# EAGLE schematic STOMPBOX_2.0 v3 (EAGLE 9.7.0)
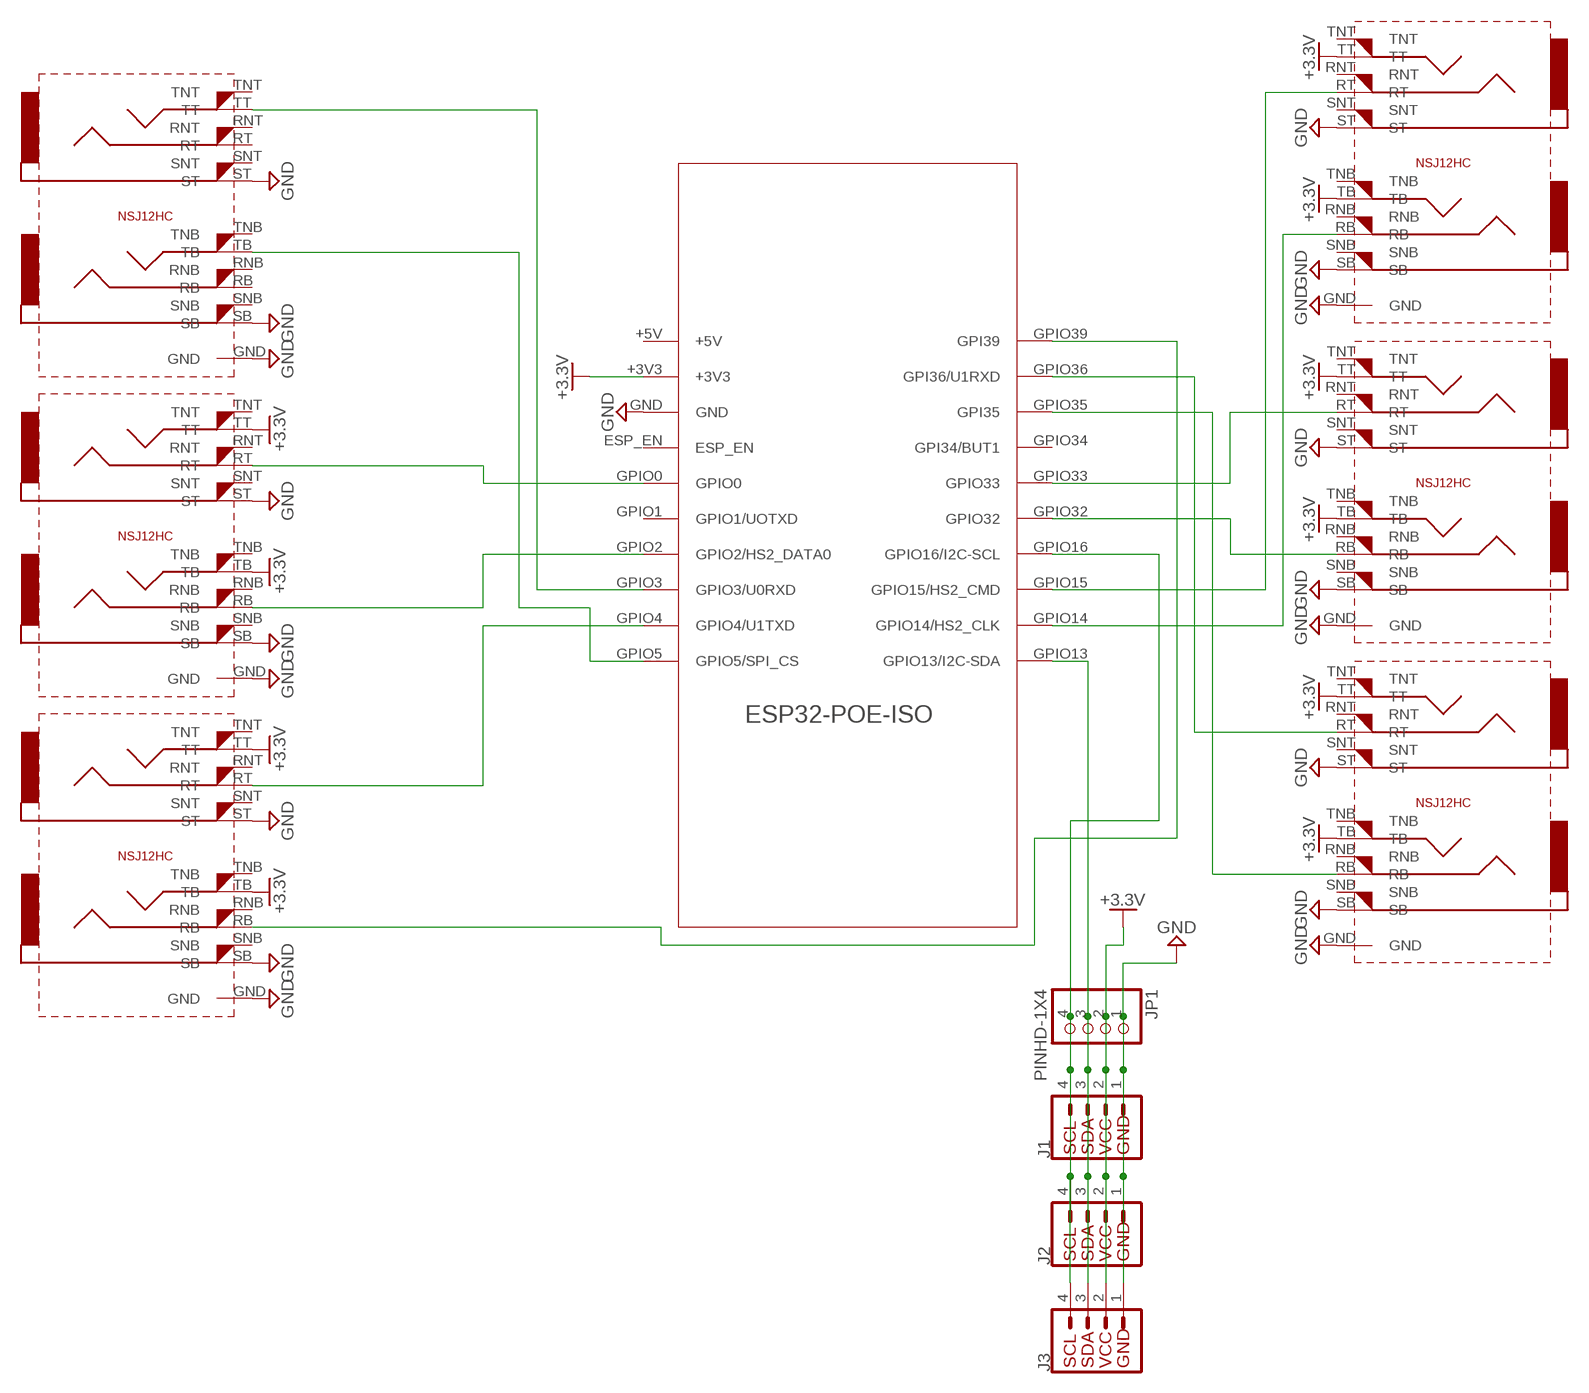
[diagram p0: schematic, sheet 1]

## Parts
J1  QWIIC_CONNECTORJS-1MM  [1X04_1MM_RA]
J2  QWIIC_CONNECTORJS-1MM  [1X04_1MM_RA]
J3  QWIIC_CONNECTORJS-1MM  [1X04_1MM_RA]
JP1  PINHD-1X4  [1X04]
U$1  NSJ12HC  [NSJ12HC]
U$2  NSJ12HC  [NSJ12HC]
U$3  NSJ12HC  [NSJ12HC]
U$4  NSJ12HC  [NSJ12HC]
U$5  NSJ12HC  [NSJ12HC]
U$6  NSJ12HC  [NSJ12HC]
U$8  ESP32-POE-ISO  [ESP32-POE-ISO]

## Nets
+3.3V: J1.2(VCC) J2.2(VCC) J3.2(VCC) JP1.2 U$2.TB U$2.TT U$3.TB U$3.TT U$4.TB U$4.TT U$5.TB U$5.TT U$6.TB U$6.TT U$8.+3V3
GND: J1.1(GND) J2.1(GND) J3.1(GND) JP1.1 U$1.GND U$1.SB U$1.ST U$2.GND U$2.SB U$2.ST U$3.GND U$3.SB U$3.ST U$4.GND U$4.SB U$4.ST U$5.GND U$5.SB U$5.ST U$6.GND U$6.SB U$6.ST U$8.GND
N$1: U$1.TT U$8.GPIO3(GPIO3/U0RXD)
N$2: U$1.TB U$8.GPIO5(GPIO5/SPI_CS)
N$3: U$2.RT U$8.GPIO0
N$4: U$2.RB U$8.GPIO2(GPIO2/HS2_DATA0)
N$5: U$3.RT U$8.GPIO4(GPIO4/U1TXD)
N$6: U$3.RB U$8.GPIO39(GPI39)
N$7: U$4.RB U$8.GPIO35(GPI35)
N$8: U$4.RT U$8.GPIO36(GPI36/U1RXD)
N$9: U$5.RT U$8.GPIO33
N$10: U$5.RB U$8.GPIO32
N$11: U$6.RT U$8.GPIO15(GPIO15/HS2_CMD)
N$12: U$6.RB U$8.GPIO14(GPIO14/HS2_CLK)
N$15: J1.4(SCL) J2.4(SCL) J3.4(SCL) JP1.4 U$8.GPIO16(GPIO16/I2C-SCL)
N$16: J1.3(SDA) J2.3(SDA) J3.3(SDA) JP1.3 U$8.GPIO13(GPIO13/I2C-SDA)
Unconnected: U$1.RB U$1.RNB U$1.RNT U$1.RT U$1.SNB U$1.SNT U$1.TNB U$1.TNT U$2.RNB U$2.RNT U$2.SNB U$2.SNT U$2.TNB U$2.TNT U$3.RNB U$3.RNT U$3.SNB U$3.SNT U$3.TNB U$3.TNT U$4.RNB U$4.RNT U$4.SNB U$4.SNT U$4.TNB U$4.TNT U$5.RNB U$5.RNT U$5.SNB U$5.SNT U$5.TNB U$5.TNT U$6.RNB U$6.RNT U$6.SNB U$6.SNT U$6.TNB U$6.TNT U$8.+5V U$8.ESP_EN U$8.GPIO1(GPIO1/UOTXD) U$8.GPIO34(GPI34/BUT1)

## Library data of the parts
J1-J3 = SparkFun-Connectors:QWIIC_CONNECTOR: SparkFun I2C Standard Qwiic Connector An SMD 1mm pitch JST connector makes it easy and quick (get it? Qwiic?) to connect I2C devices to each other. The Qwiic system <http://www.sparkfun.com/qwiic> enables fast and solderless connection between popular platforms and various sensors and actuators. We carry 200mm <https://www.sparkfun.com/products/14204>, 100mm <https://www.sparkfun.com/products/14205>, 50mm <https://www.sparkfun.com/products/14206>, and breadboard friendly <https://www.sparkfun.com/products/14207> Qwiic cables. We also offer 10 pcs strips <https://www.sparkfun.com/products/14323> the SMD connectors.
JP1 = Connector:PINHD-1X4: PIN HEADER; CATEGORY: CONNECTOR; SUB-CATEGORY: PIN-HEADER
U$1-U$6 = ESP32-PoE-ISO:NSJ12HC
U$8 = ESP32-PoE-ISO:ESP32-POE-ISO